# Altium schematic sheet HOMER3E-V3.5-G510.SchDoc
size A2; SheetNumber: 0; SheetTotal: 0
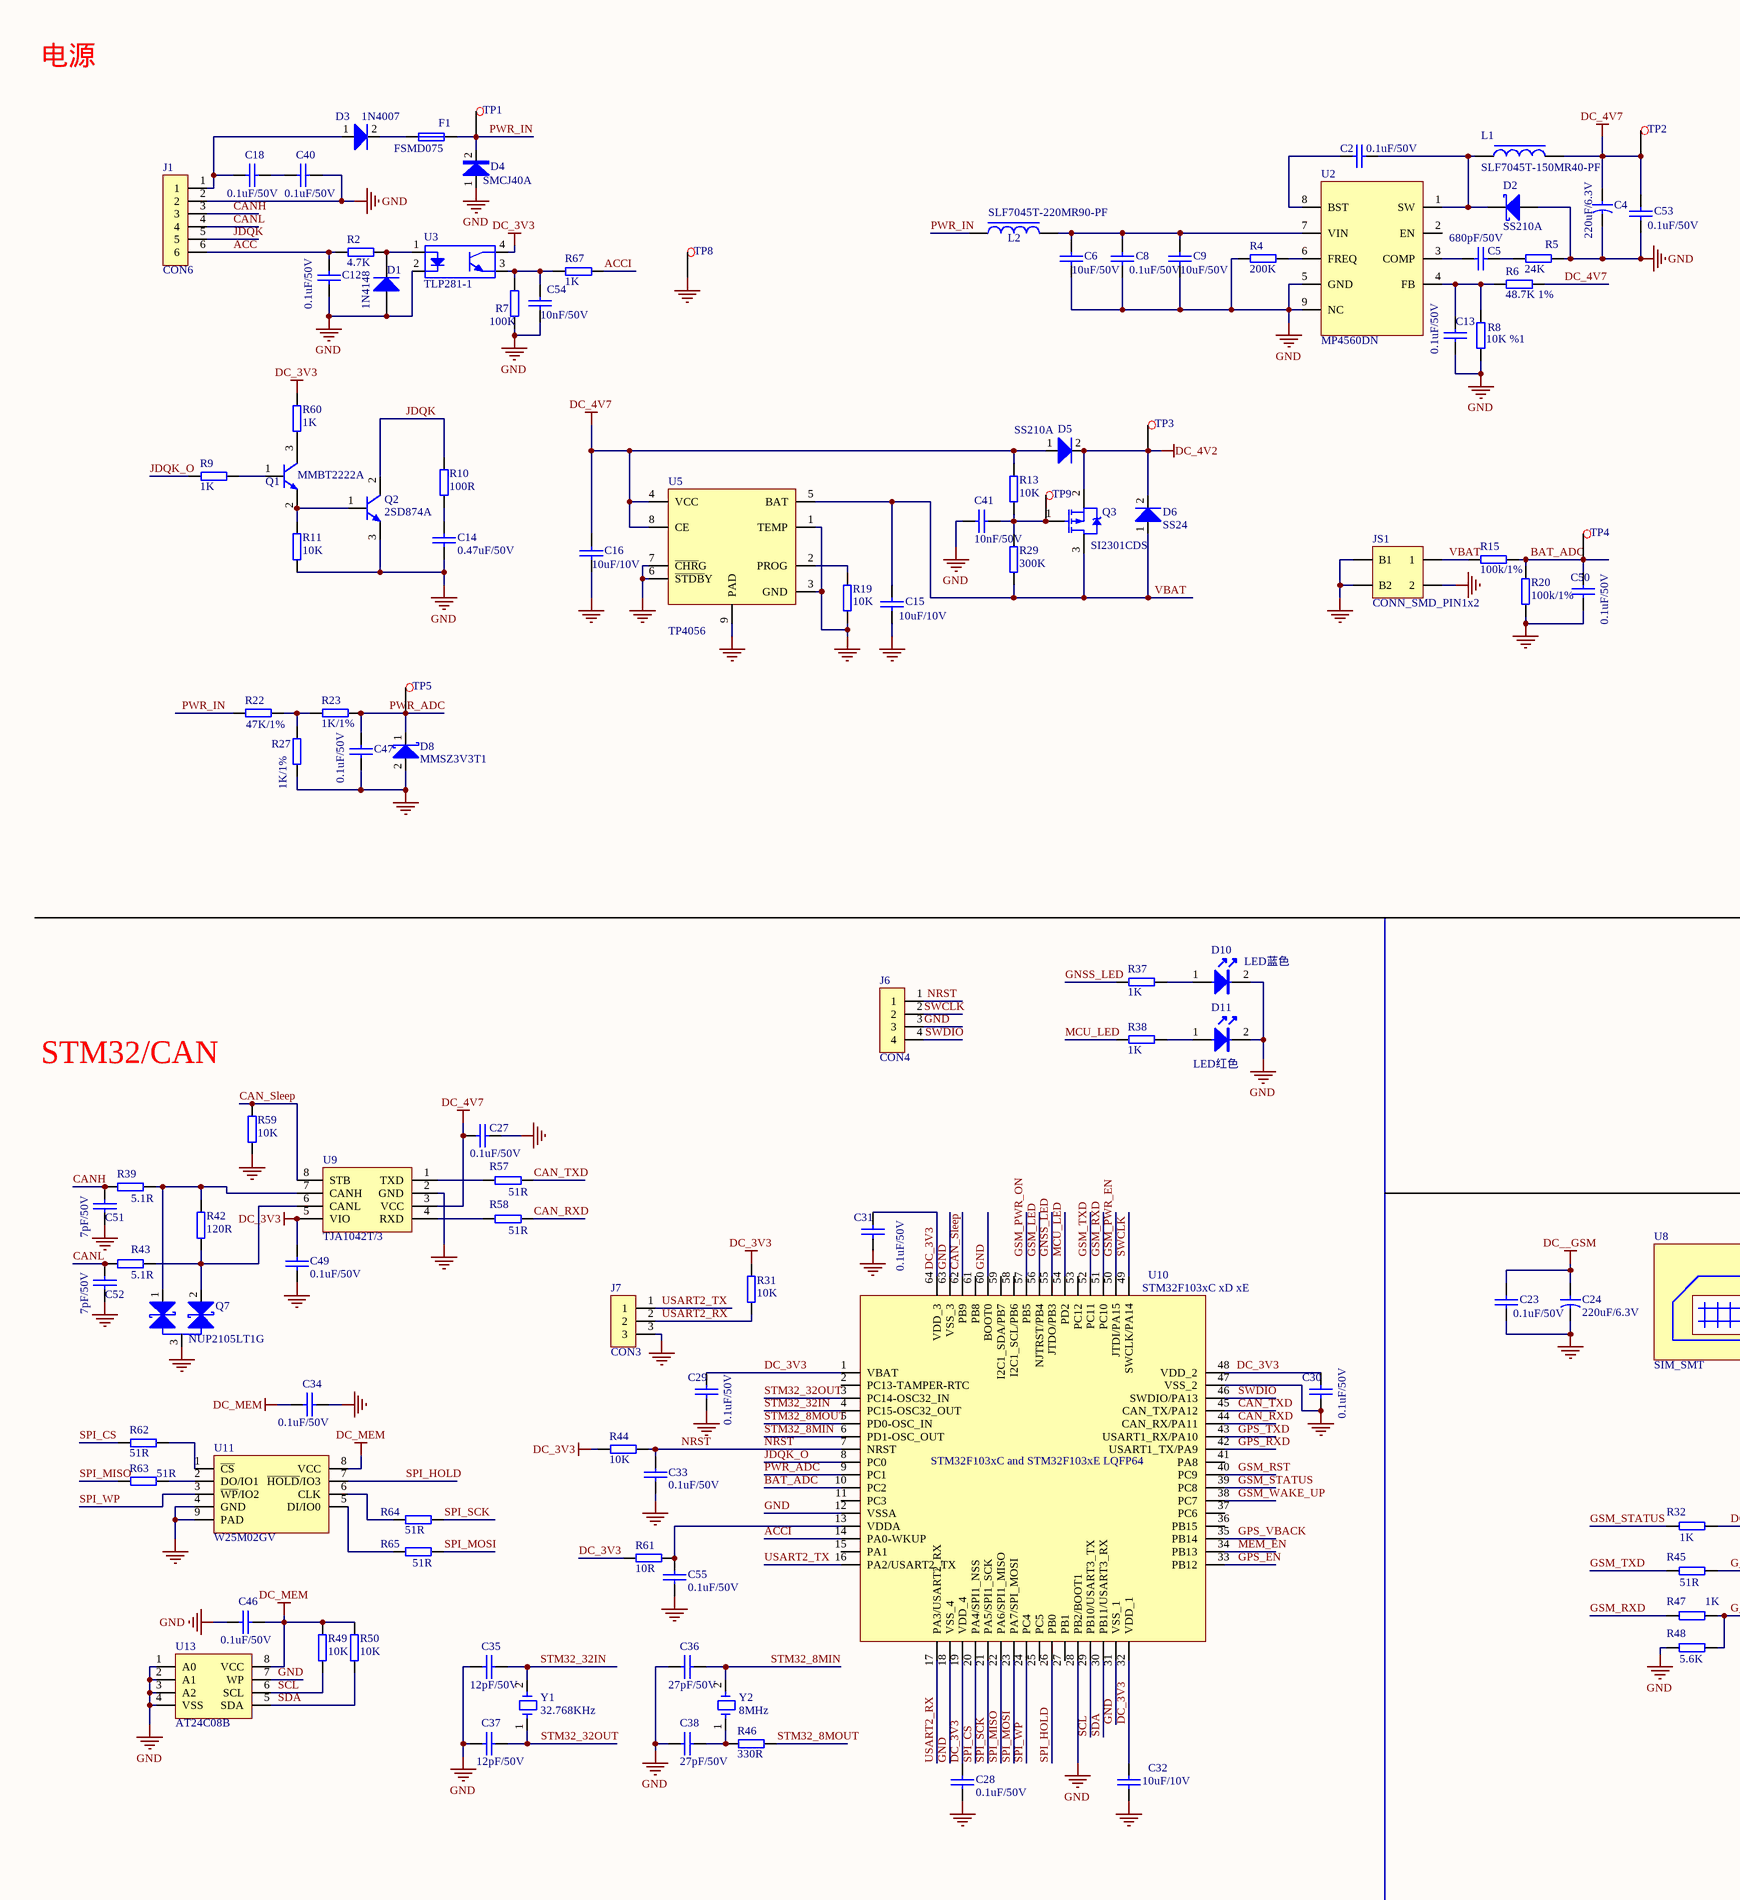
[diagram p0: HOMER3E-V3.5-G510.SchDoc, left]
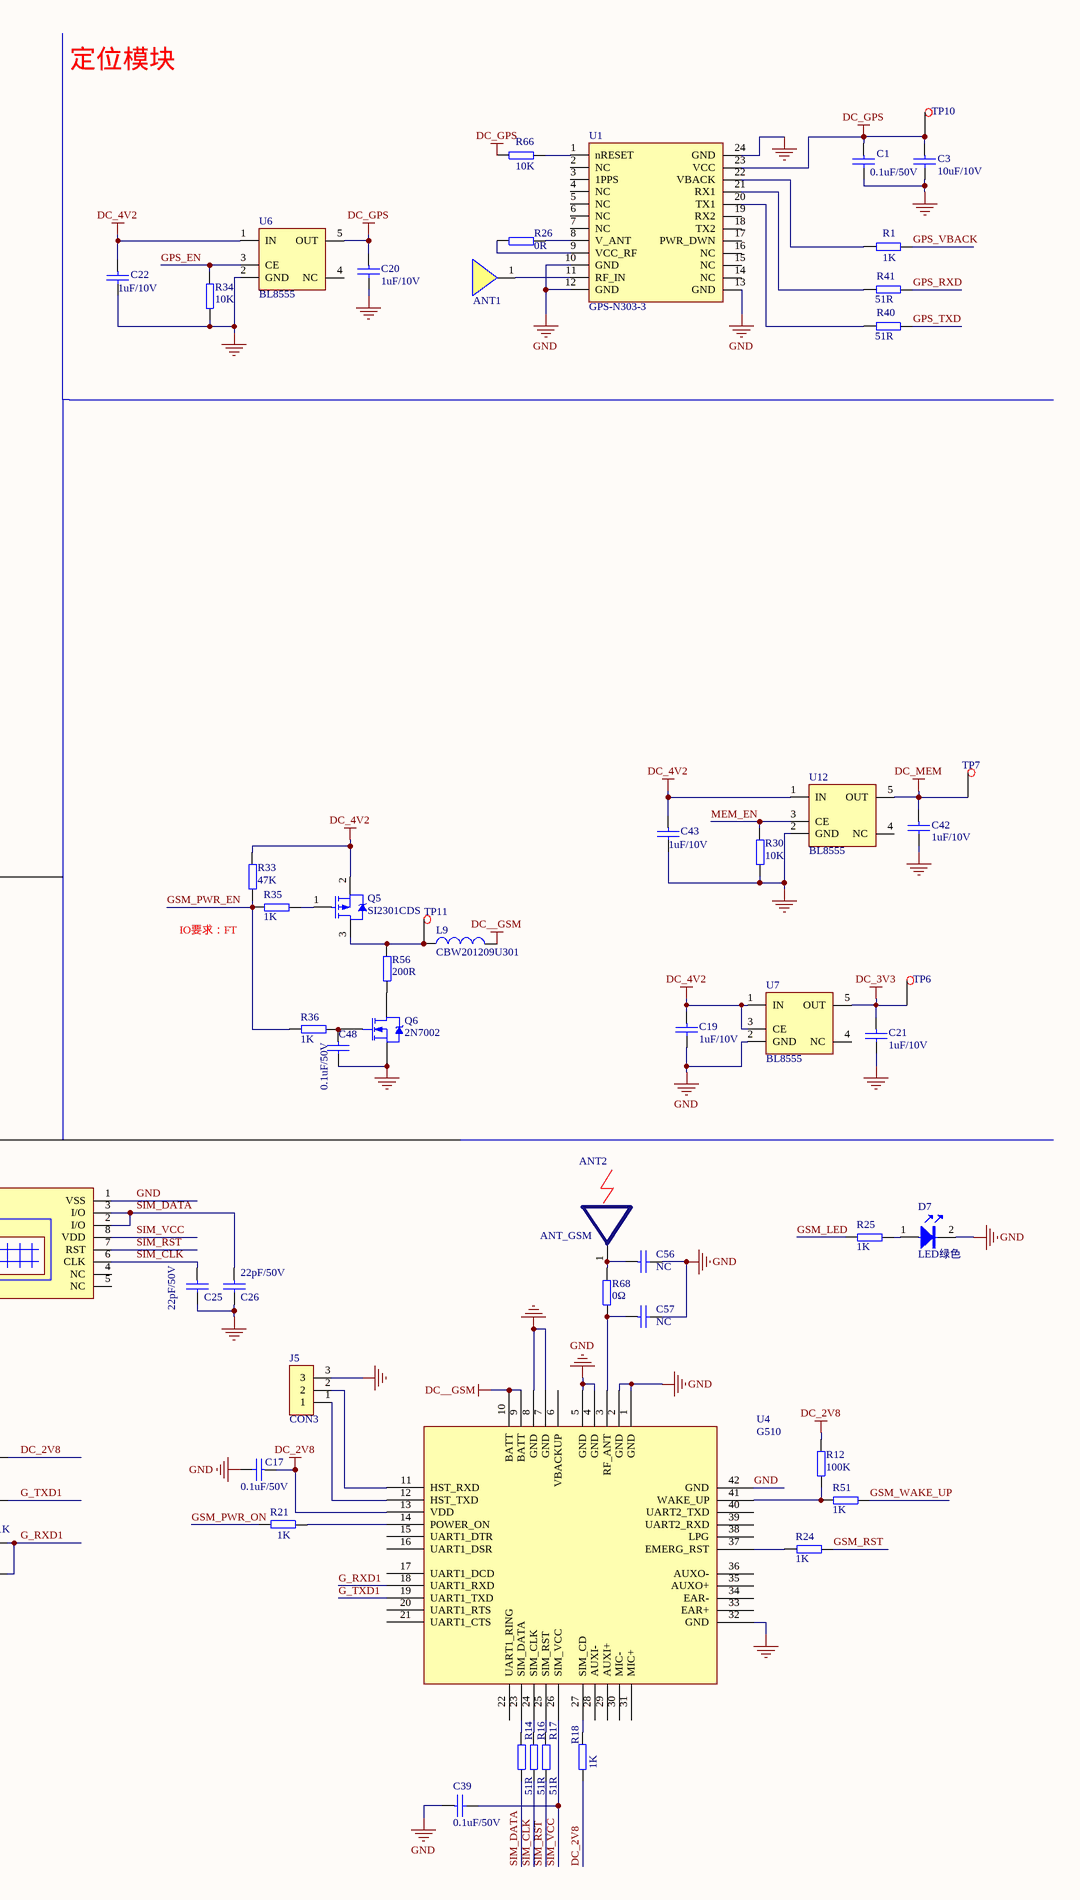
[diagram p1: HOMER3E-V3.5-G510.SchDoc, right]

## Parts
ANT1  ANT  [GPS_ANT_25*25]  (value not drawn)
ANT2  ANT_GSM  [GSM_ANT]
C1  0.1uF/50V  [0603]
C2  0.1uF/50V  [0603]
C3  10uF/10V  [0603]
C4  220uF/6.3V  [7343]
C5  680pF/50V  [0603]
C6  10uF/50V  [1206]
C8  0.1uF/50V  [0805]
C9  10uF/50V  [1206]
C12  0.1uF/50V  [0805]
C13  0.1uF/50V  [0603]
C14  0.47uF/50V  [0805]
C15  10uF/10V  [0603]
C16  10uF/10V  [0603]
C17  0.1uF/50V  [0603]
C18  0.1uF/50V  [0805]
C19  1uF/10V  [0603]
C20  1uF/10V  [0603]
C21  1uF/10V  [0603]
C22  1uF/10V  [0603]
C23  0.1uF/50V  [0603]
C24  220uF/6.3V  [7343]
C25  22pF/50V  [0603]
C26  22pF/50V  [0603]
C27  0.1uF/50V  [0603]
C28  0.1uF/50V  [0603]
C29  0.1uF/50V  [0603]
C30  0.1uF/50V  [0603]
C31  0.1uF/50V  [0603]
C32  10uF/10V  [0603]
C33  0.1uF/50V  [0603]
C34  0.1uF/50V  [0603]
C35  12pF/50V  [0603]
C36  27pF/50V  [0603]
C37  12pF/50V  [0603]
C38  27pF/50V  [0603]
C39  0.1uF/50V  [0603]
C40  0.1uF/50V  [0805]
C41  10nF/50V  [0603]
C42  1uF/10V  [0603]
C43  1uF/10V  [0603]
C46  0.1uF/50V  [0603]
C47  0.1uF/50V  [0603]
C48  0.1uF/50V  [0603]
C49  0.1uF/50V  [0603]
C50  0.1uF/50V  [0603]
C51  7pF/50V  [0603]
C52  7pF/50V  [0603]
C53  0.1uF/50V  [0603]
C54  10nF/50V  [0603]
C55  0.1uF/50V  [0603]
C56  NC  [C0603]
C57  NC  [C0603]
D1  1N4148  [SOD-123]
D2  SS210A  [DO-214AC]
D3  1N4007  [DO-214AC]
D4  SMCJ40A  [SMCJ40A]
D5  SS210A  [DO-214AC]
D6  SS24  [DO-214AC]
D7  LED绿色  [0603_led]
D8  MMSZ3V3T1  [SOD-123]
D10  LED蓝色  [0603_led]
D11  LED红色  [0603_led]
F1  FSMD075  [2920]
J1  CON6  [CON6]
J5  CON3  [PH-3(2.54)]
J6  CON4  [PH-4(2.54)]
J7  CON3  [PH-3(2.54)]
JS1  CONN_SMD_PIN1x2  [MOLEX_53261-0271]
L1  SLF7045T-150MR40-PF  [MURATA_7 X 7]
L2  SLF7045T-220MR90-PF  [MURATA_7 X 7]
L9  CBW201209U301  [0805]
Q1  MMBT2222A  [SOT23-3]
Q2  2SD874A  [SOT-89-3L]
Q3  SI2301CDS  [SOT23-3]
Q5  SI2301CDS  [SOT23-3]
Q6  2N7002  [SOT23-3]
Q7  NUP2105LT1G  [SOT23-3]
R1  1K  [0603]
R2  4.7K  [0603]
R4  200K  [0603]
R5  24K  [0603]
R6  48.7K 1%  [0603]
R7  100K  [0603]
R8  10K %1  [0603]
R9  1K  [0603]
R10  100R  [0805]
R11  10K  [0603]
R12  100K  [0603]
R13  10K  [0603]
R14  51R  [0603]
R15  100k/1%  [0603]
R16  51R  [0603]
R17  51R  [0603]
R18  1K  [0603]
R19  10K  [0603]
R20  100k/1%  [0603]
R21  1K  [0603]
R22  47K/1%  [0603]
R23  1K/1%  [0603]
R24  1K  [0603]
R25  1K  [0603]
R26  0R  [0603]
R27  1K/1%  [0603]
R29  300K  [0603]
R30  10K  [0603]
R31  10K  [0603]
R32  1K  [0603]
R33  47K  [0603]
R34  10K  [0603]
R35  1K  [0603]
R36  1K  [0603]
R37  1K  [0603]
R38  1K  [0603]
R39  5.1R  [0603]
R40  51R  [0603]
R41  51R  [0603]
R42  120R  [0805]
R43  5.1R  [0603]
R44  10K  [0603]
R45  51R  [0603]
R46  330R  [0603]
R47  1K  [0603]
R48  5.6K  [0603]
R49  10K  [0603]
R50  10K  [0603]
R51  1K  [0603]
R56  200R  [0805]
R57  51R  [0603]
R58  51R  [0603]
R59  10K  [0603]
R60  1K  [0603]
R61  10R  [0603]
R62  51R  [0603]
R63  51R  [0603]
R64  51R  [0603]
R65  51R  [0603]
R66  10K  [0603]
R67  1K  [0603]
R68  0Ω  [R0603]
TP1  TestPoint  [TESTPOINT]  (value not drawn)
TP2  TestPoint  [TESTPOINT]  (value not drawn)
TP3  TestPoint  [TESTPOINT]  (value not drawn)
TP4  TestPoint  [TESTPOINT]  (value not drawn)
TP5  TestPoint  [TESTPOINT]  (value not drawn)
TP6  TestPoint  [TESTPOINT]  (value not drawn)
TP7  TestPoint  [TESTPOINT]  (value not drawn)
TP8  TestPoint  [TESTPOINT]  (value not drawn)
TP9  TestPoint  [TESTPOINT]  (value not drawn)
TP10  TestPoint  [TESTPOINT]  (value not drawn)
TP11  TestPoint  [TESTPOINT]  (value not drawn)
U1  GPS-N303-3  [N303-3]
U2  MP4560DN  [MP4560DN_FOOTPRINT]
U3  TLP281-1  [tlp281]
U4  G510  [G510-Q50-20]
U5  TP4056  [MP4560DN_FOOTPRINT]
U6  BL8555  [SOT23-5]
U7  BL8555  [SOT23-5]
U8  SIM_SMT  [SIM_SMT]
U9  TJA1042T/3  [SO-8]
U10  STM32F103xC xD xE  [TQFP-64]
U11  W25M02GV  [WSON8X6-8]
U12  BL8555  [SOT23-5]
U13  AT24C08B  [SO-8]
Y1  32.768KHz  [XTAL_FC-135]
Y2  8MHz  [XTAL_5032_2]

## Nets
DC_2V8: C17.1 R12.1 R18.1 R32.1 U4.13(VDD)
DC_3V3: C21.1 C28.1 C29.1 C30.1 C31.1 C32.1 C49.2 R31.1 R44.2 R60.2 R61.2 TP6.1 U3.4 U7.5(OUT) U9.5(VIO) U10.1(VBAT) U10.19(VDD_4) U10.32(VDD_1) U10.48(VDD_2) U10.64(VDD_3)
DC_4V2: C19.1 C22.1 C43.1 D5.2(K) D6.2(K) Q3.2(D) Q5.2(D) R33.1 TP3.1 U6.1(IN) U7.1(IN) U7.3(CE) U12.1(IN)
DC_4V7: C4.1 C16.1 C27.1 C53.1 D5.1(A) L1.2 R6.1 R13.1 TP2.1 U5.4(VCC) U5.8(CE) U9.3(VCC)
DC__GSM: C23.1 C24.1 L9.2 U4.9(BATT) U4.10(BATT)
DC_GPS: C1.1 C3.1 C20.1 R66.1 TP10.1 U1.23(VCC) U6.5(OUT)
DC_MEM: C34.2 C42.1 C46.1 R49.1 R50.1 TP7.1 U11.8(VCC) U12.5(OUT) U13.8(VCC)
GND: C1.2 C3.2 C4.2 C6.2 C8.2 C9.1 C12.2 C13.2 C14.2 C15.2 C16.2 C17.2 C19.2 C20.2 C21.2 C22.2 C23.2 C24.2 C25.2 C26.2 C27.2 C28.2 C29.2 C30.2 C31.2 C32.2 C33.2 C34.1 C35.1 C36.1 C37.1 C38.1 C39.1 C40.2 C41.2 C42.2 C43.2 C46.2 C47.2 C48.2 C49.1 C50.2 C51.2 C52.2 C53.2 C54.2 C55.2 C56.2 C57.2 D1.1(A) D2.1(A) D4.1(A) D7.2(K) D8.2(A) D10.2(K) D11.2(K) J1.2 J5.3 J6.3 J7.3 JS1.2 JS1.B1 JS1.B2 Q2.3(C) Q6.3(S) Q7.3 R4.2 R5.1 R7.2 R8.2 R11.2 R19.2 R20.2 R27.2 R30.2 R34.2 R48.2 R59.2 TP8.1 U1.10(GND) U1.12(GND) U1.13(GND) U1.24(GND) U2.5(GND) U2.9(NC) U3.2 U4.1(GND) U4.2(GND) U4.4(GND) U4.5(GND) U4.7(GND) U4.8(GND) U4.32(GND) U4.42(GND) U5.1(TEMP) U5.3(GND) U5.6(~{STDB}Y) U5.7(~{CHR}G) U5.9(PAD) U6.2(GND) U7.2(GND) U8.1(VSS) U9.2(GND) U10.12(VSSA) U10.18(VSS_4) U10.28(PB2/BOOT1) U10.31(VSS_1) U10.47(VSS_2) U10.60(BOOT0) U10.63(VSS_3) U11.4(GND) U11.9(PAD) U12.2(GND) U13.1(A0) U13.2(A1) U13.3(A2) U13.4(VSS) U13.7(WP)
ACC: C12.1 J1.6 R2.2
ACCI: R67.2 U10.14(PA0-WKUP)
BAT_ADC: C50.1 R15.1 R20.1 TP4.1 U10.10(PC2)
CAN_RXD: R58.2 U10.44(CAN_RX/PA11)
CAN_Sleep: R59.1 U9.8(STB) U10.62(PB9)
CAN_TXD: R57.2 U10.45(CAN_TX/PA12)
CANH: C51.1 J1.3 R39.2
CANL: C52.1 J1.4 R43.2
G_RXD1: R47.1 R48.1 U4.18(UART1_RXD)
G_TXD1: R45.1 U4.19(UART1_TXD)
GNSS_LED: R37.1 U10.55(JTDO/PB3)
GPS_EN: R34.1 U6.3(CE) U10.33(PB12)
GPS_RXD: R41.1 U10.42(USART1_TX/PA9)
GPS_TXD: R40.1 U10.43(USART1_RX/PA10)
GPS_VBACK: R1.1 U10.35(PB14)
GSM_LED: R25.1 U10.56(NJTRST/PB4)
GSM_PWR_EN: R33.2 R35.1 R36.2 U10.50(JTDI/PA15)
GSM_PWR_ON: R21.2 U10.57(PB5)
GSM_RST: R24.2 U10.40(PC9)
GSM_RXD: R47.2 U10.51(PC10)
GSM_STATUS: R32.2 U10.39(PC8)
GSM_TXD: R45.2 U10.52(PC11)
GSM_WAKE_UP: R51.2 U10.38(PC7)
JDQK: J1.5 Q2.2(B) R10.1
JDQK_O: R9.1 U10.8(PC0)
MCU_LED: R38.2 U10.54(PD2)
MEM_EN: R30.1 U10.34(PB13) U12.3(CE)
NRST: C33.1 J6.1 R44.1 U10.7(NRST)
PWR_ADC: C47.1 D8.1(K) R23.1 TP5.1 U10.9(PC1)
PWR_IN: D4.2(K) F1.2 L2.1 R22.2 TP1.1
SCL: R49.2 U10.29(PB10/USART3_TX) U13.6(SCL)
SDA: R50.2 U10.30(PB11/USART3_RX) U13.5(SDA)
SIM_CLK: C25.1 R16.2 U8.6(CLK)
SIM_DATA: C26.1 R14.2 U8.2(I/O) U8.3(I/O)
SIM_RST: R17.2 U8.7(RST)
SIM_VCC: C39.2 U4.26(SIM_VCC) U8.8(VDD)
SPI_CS: R62.1 U10.20(PA4/SPI1_NSS)
SPI_HOLD: U10.26(PB0) U11.7(~{HOLD}/IO3)
SPI_MISO: R63.1 U10.22(PA6/SPI1_MISO)
SPI_MOSI: R65.2 U10.23(PA7/SPI_MOSI)
SPI_SCK: R64.2 U10.21(PA5/SPI1_SCK)
SPI_WP: U10.24(PC4) U11.3(~{WP}/IO2)
STM32_8MIN: C36.2 U10.6(PD1-OSC_OUT) Y2.2(OSC2)
STM32_8MOUT: R46.2 U10.5(PD0-OSC_IN)
STM32_32IN: C35.2 U10.4(PC15-OSC32_OUT) Y1.2(OSC2)
STM32_32OUT: C37.2 U10.3(PC14-OSC32_IN) Y1.1(OSC1)
SWCLK: J6.2 U10.49(SWCLK/PA14)
SWDIO: J6.4 U10.46(SWDIO/PA13)
USART2_RX: J7.2 R31.2 U10.17(PA3/USART2_RX)
USART2_TX: J7.1 U10.16(PA2/USART2_TX)
VBAT: C15.1 D6.1(A) JS1.1 Q3.3(S) R15.2 R29.2 U5.5(BAT)
NetANT1_1: ANT1.1(ANT) U1.11(RF_IN)
NetANT2_1: ANT2.1 C56.1 R68.2
NetC2_1: C2.1 U2.8(BST)
NetC2_2: C2.2 D2.2(K) L1.1 U2.1(SW)
NetC5_1: C5.1 U2.3(COMP)
NetC5_2: C5.2 R5.2
NetC6_1: C6.1 C8.1 C9.2 L2.2 U2.7(VIN)
NetC13_1: C13.1 R6.2 R8.1 U2.4(FB)
NetC14_1: C14.1 R10.2
NetC18_1: C18.1 D3.1(A) J1.1
NetC18_2: C18.2 C40.1
NetC38_2: C38.2 R46.1 Y2.1(OSC1)
NetC41_1: C41.1 Q3.1(G) R13.2 R29.1 TP9.1
NetC48_1: C48.1 Q6.1(G) R36.1
NetC54_1: C54.1 R7.1 R67.1 U3.3
NetC55_1: C55.1 R61.1 U10.13(VDDA)
NetC57_1: C57.1 R68.1 U4.3(RF_ANT)
NetD1_2: D1.2(K) R2.1 U3.1
NetD3_2: D3.2(K) F1.1
NetD7_1: D7.1(A) R25.2
NetD10_1: D10.1(A) R37.2
NetD11_1: D11.1(A) R38.1
NetJ5_1: J5.1 U4.12(HST_TXD)
NetJ5_2: J5.2 U4.11(HST_RXD)
NetL9_1: L9.1 Q5.3(S) R56.1 TP11.1
NetQ1_1: Q1.1(E) R9.2
NetQ1_2: Q1.2(B) Q2.1(E) R11.1
NetQ1_3: Q1.3(C) R60.1
NetQ5_1: Q5.1(G) R35.2
NetQ6_2: Q6.2(D) R56.2
NetQ7_1: Q7.1 R39.1 R42.1 U9.7(CANH)
NetQ7_2: Q7.2 R42.2 R43.1 U9.6(CANL)
NetR1_2: R1.2 U1.22(VBACK)
NetR4_1: R4.1 U2.6(FREQ)
NetR12_2: R12.2 R51.1 U4.41(WAKE_UP)
NetR14_1: R14.1 U4.23(SIM_DATA)
NetR16_1: R16.1 U4.24(SIM_CLK)
NetR17_1: R17.1 U4.25(SIM_RST)
NetR18_2: R18.2 U4.27(SIM_CD)
NetR19_1: R19.1 U5.2(PROG)
NetR21_1: R21.1 U4.14(POWER_ON)
NetR22_1: R22.1 R23.2 R27.1
NetR24_1: R24.1 U4.37(EMERG_RST)
NetR26_1: R26.1 U1.9(VCC_RF)
NetR26_2: R26.2 U1.8(V_ANT)
NetR40_2: R40.2 U1.20(TX1)
NetR41_2: R41.2 U1.21(RX1)
NetR57_1: R57.1 U9.1(TXD)
NetR58_1: R58.1 U9.4(RXD)
NetR62_2: R62.2 U11.1(~{CS})
NetR63_2: R63.2 U11.2(DO/IO1)
NetR64_1: R64.1 U11.6(CLK)
NetR65_1: R65.1 U11.5(DI/IO0)
NetR66_2: R66.2 U1.1(nRESET)

Not connected (* = marked no-connect by the designer): U1 2(NC) 3(1PPS) 4(NC) 5(NC) 6(NC) 7(NC) 14(NC) 15(NC) 16(NC) 17(PWR_DWN) 18(TX2) 19(RX2); U2 2(EN); U4 6(VBACKUP) 15(UART1_DTR) 16(UART1_DSR) 17(UART1_DCD) 20(UART1_RTS) 21(UART1_CTS) 22(UART1_RING) 28(AUXI-) 29(AUXI+) 30(MIC-) 31(MIC+) 33(EAR+) 34(EAR-) 35(AUXO+) 36(AUXO-) 38(LPG) 39(UART2_RXD) 40(UART2_TXD); U6 4(NC); U7 4(NC); U8 4(NC) 5(NC); U10 2(PC13-TAMPER-RTC) 11(PC3) 15(PA1) 25(PC5) 27(PB1) 36(PB15) 37(PC6) 41(PA8) 53(PC12) 58(I2C1_SCL/PB6) 59(I2C1_SDA/PB7) 61(PB8); U12 4(NC)

## Notes on the sheet
- 电源
- 定位模块
- IO要求：FT
- STM32/CAN
- (in symbol STM32F103xC xD xE) STM32F103xC and STM32F103xE LQFP64

## Library data of the parts
C1-C3 C5 C6 C8 C9 C12-C23 C25-C43 C46-C57 = CAP: Capacitor
C4 C24 = Cap1: Capacitor
D1 = Diode: Default Diode; Published: 8-Jun-2000; LatestRevisionDate: 17-Jul-2002; LatestRevisionNote: Re-released for DXP Platform.; PackageVersion: Sep-1996; PackageReference: SMC; Publisher: Altium Limited; Code_JEDEC: DO-214-AB
D2 = B340A: Schottky Diode
D3 D5 D6 = 1N4007: High Conductance Fast Diode
D7 D10 D11 = LED
D8 = MMSZ3V3T1: TVS
F1 = Fuse
L1 = INDUCTOR_2: INDUCTOR
L2 = Inductor: Magnetic-Core Inductor
L9 = Inductor: Code_IEC: 1005; Value: 10mH; Published: 8-Jun-2000; LatestRevisionDate: 29-May-2009; LatestRevisionNote: IPC-7351 Footprint Added.; PackageReference: 0402-A; Publisher: Altium Limited; PackageDescription: Chip Inductor; Code_JEITA: 0402
Q2 = 2SD874: NPN General Purpose Amplifier
Q3 = AO3415A: P-Channel Power MOSFET
Q5 = Si2301ADS
Q6 = NMOS-2: N-Channel Power MOSFET; Note: Pin 2 is electrically connected to pin 4.; Published: 8-Jun-2000; LatestRevisionDate: 17-Jul-2002; LatestRevisionNote: Re-released for DXP Platform.; DatasheetVersion: PD-9.814; PackageReference: TO-220AB; Publisher: Altium Limited; Code_JEDEC: TO-220-AB; ComponentLink1Description: Manufacturer Link; ComponentLink1URL: http://www.irf.com/
R1 R2 R4-R17 R19-R27 R29-R51 R56-R68 = Res: Resistor
R18 = RES_0603
U3 = TLP281-1: 光电耦合器
U13 = AT24C08B: 8K I2C CMOS Serial EEPROM
Y1 Y2 = XTAL: Crystal Oscillator; Value: 4MHz